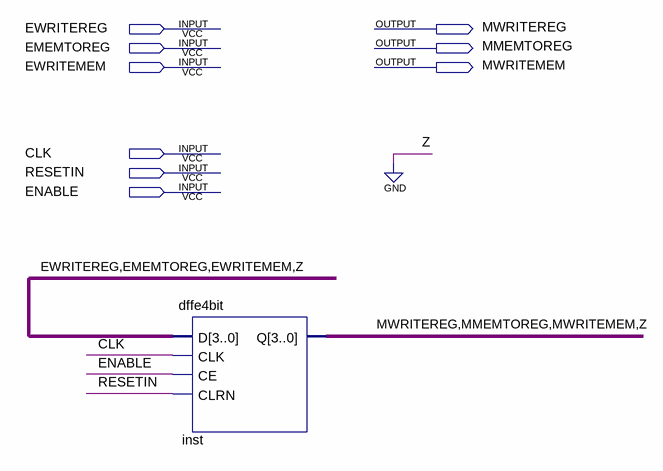
[diagram p0: schematic sheet]
// Quartus schematic EXE-MEM-SIGNAL-BUFFER.bdf as structural Verilog: 1 symbols, 9 pins
module \EXE-MEM-SIGNAL-BUFFER  (
  input  EWRITEREG,
  input  EMEMTOREG,
  input  EWRITEMEM,
  input  CLK,
  input  RESETIN,
  input  ENABLE,
  output MWRITEREG,
  output MMEMTOREG,
  output MWRITEMEM
);

  wire Z;

  dffe4bit inst (
    .D({EWRITEREG, EMEMTOREG, EWRITEMEM, Z}), .CLK(CLK), .CE(ENABLE), .CLRN(RESETIN),
    .Q({MWRITEREG, MMEMTOREG, MWRITEMEM, Z}));
  // also tied to GND on the sheet: Z
endmodule
